# EAGLE design MaTouch Lite ESP32-S3 SPI TFT with Touch 3.95'' ST7796 v1.1 (EAGLE 6.1)
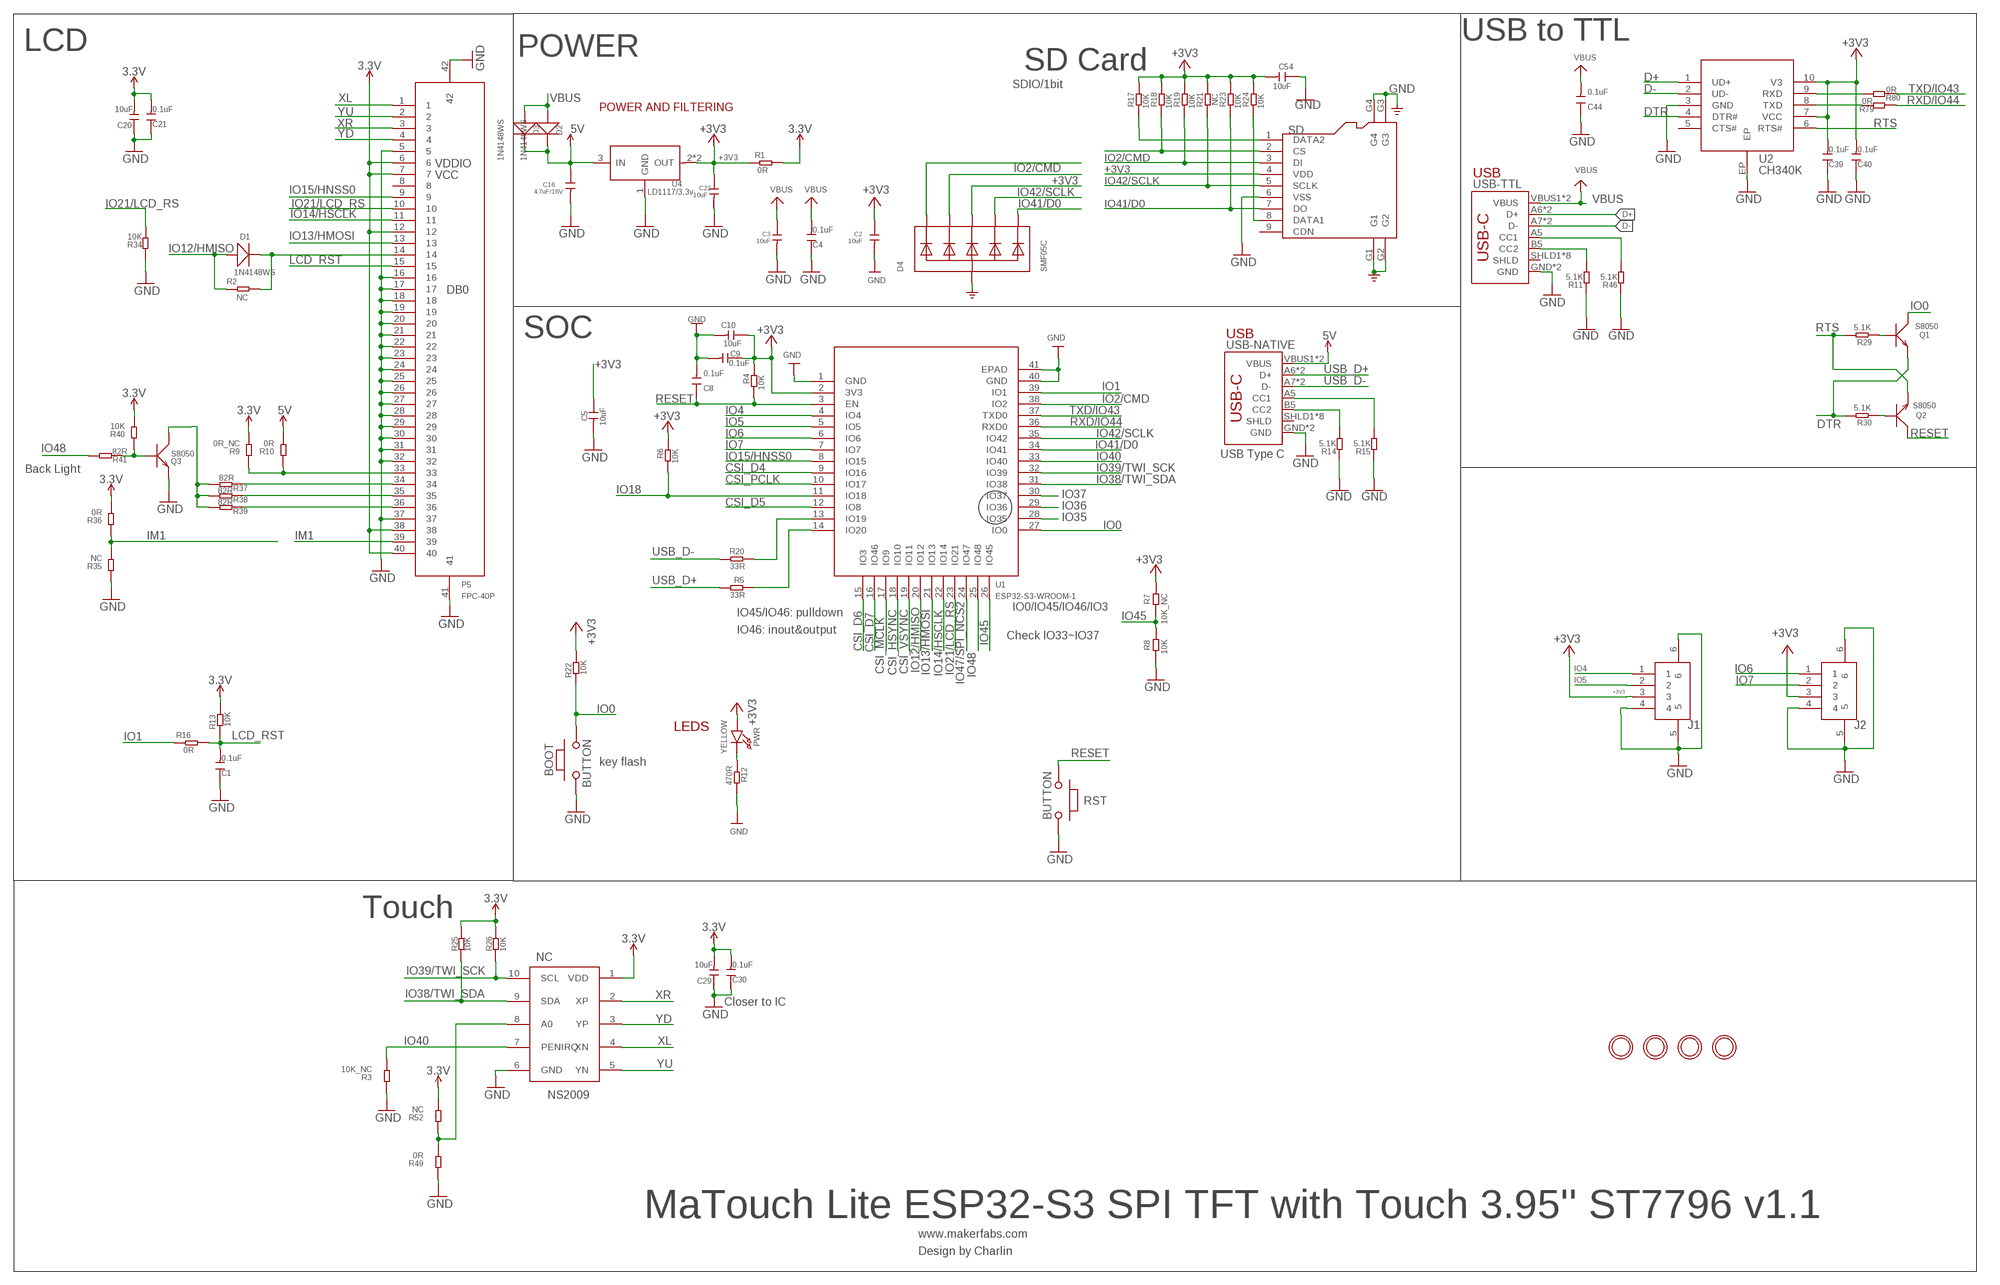
[diagram p0: schematic, sheet 1]

## Parts
BOOT  BUTTON  PB157  [157SW]
C1  0.1uF  DISCRETE_C-0603  [DISCRETE_C0603]
C2  10uF  C-0603  [0603]
C3  10uF  C-0603  [0603]
C4  0.1uF  DISCRETE_C-0603  [DISCRETE_C0603]
C5  10uF  DISCRETE_C-0603  [DISCRETE_C0603]
C8  0.1uF  DISCRETE_C-0603  [DISCRETE_C0603]
C9  0.1uF  DISCRETE_C-0603  [DISCRETE_C0603]
C10  10uF  DISCRETE_C-0603  [DISCRETE_C0603]
C16  4.7uF/16V  C-0603  [0603]
C20  10uF  DISCRETE_C-0603  [DISCRETE_C0603]
C21  0.1uF  DISCRETE_C-0603  [DISCRETE_C0603]
C22  10uF  C-0603  [0603]
C29  10uF  DISCRETE_C-0603  [DISCRETE_C0603]
C30  0.1uF  DISCRETE_C-0603  [DISCRETE_C0603]
C39  0.1uF  DISCRETE_C-0603  [DISCRETE_C0603]
C40  0.1uF  DISCRETE_C-0603  [DISCRETE_C0603]
C44  0.1uF  DISCRETE_C-0603  [DISCRETE_C0603]
C54  10uF  DISCRETE_C-0603  [DISCRETE_C0603]
D1  1N4148WS  D'0805'  [SOD323]
D2  1N4148WS  D'0805'  [SOD323]
D3  1N4148WS  D'0805'  [SOD323]
D4  SMF05C  TVSARRAY_5LANE  [SOT363]
H1  MICROBUILDER_MOUNTINGHOLE3.0THIN  [MICROBUILDER_MOUNTINGHOLE_3.0_PLATEDTHIN]
H2  MICROBUILDER_MOUNTINGHOLE3.0THIN  [MICROBUILDER_MOUNTINGHOLE_3.0_PLATEDTHIN]
H3  MICROBUILDER_MOUNTINGHOLE3.0THIN  [MICROBUILDER_MOUNTINGHOLE_3.0_PLATEDTHIN]
H4  MICROBUILDER_MOUNTINGHOLE3.0THIN  [MICROBUILDER_MOUNTINGHOLE_3.0_PLATEDTHIN]
J1  CON4-1.25P-SMD  [SMD4-125P-1000L525W350H]
J2  CON4-1.25P-SMD  [SMD4-125P-1000L525W350H]
P5  FPC-40P  [SMD42-50P-2560L490W]
PWR  YELLOW  LED0805_NOOUTLINE  [CHIPLED_0805_NOOUTLINE]
Q1  S8050  TRANSISTOR-NPN-SOT23  [SOT23]
Q2  S8050  TRANSISTOR-NPN-SOT23  [SOT23]
Q3  S8050  TRANSISTOR-NPN-SOT23  [SOT23]
R1  0R  R-0603  [R0603]
R2  NC  R-0603  [R0603]
R3  10K_NC  DISCRETE_R-0603  [DISCRETE_R0603]
R4  10K  R-0603  [R0603]
R5  33R  R-0603  [R0603]
R6  10K  R-0603  [R0603]
R7  10K_NC  R-0603  [R0603]
R8  10K  R-0603  [R0603]
R9  0R_NC  DISCRETE_R-0603  [DISCRETE_R0603]
R10  0R  DISCRETE_R-0603  [DISCRETE_R0603]
R11  5.1K  DISCRETE_R-0603  [DISCRETE_R0603]
R12  470R  R-0603  [R0603]
R13  10K  R-0603  [R0603]
R14  5.1K  DISCRETE_R-0603  [DISCRETE_R0603]
R15  5.1K  DISCRETE_R-0603  [DISCRETE_R0603]
R16  0R  R-0603  [R0603]
R17  10K  R-0603  [R0603]
R18  10K  R-0603  [R0603]
R19  10K  R-0603  [R0603]
R20  33R  R-0603  [R0603]
R21  NC  R-0603  [R0603]
R22  10K  R-0603  [R0603]
R23  10K  R-0603  [R0603]
R24  10K  R-0603  [R0603]
R25  10K  R-0603  [R0603]
R26  10K  R-0603  [R0603]
R29  5.1K  R-0603  [R0603]
R30  5.1K  R-0603  [R0603]
R34  10K  DISCRETE_R-0603  [DISCRETE_R0603]
R35  NC  DISCRETE_R-0603  [DISCRETE_R0603]
R36  0R  DISCRETE_R-0603  [DISCRETE_R0603]
R37  82R  DISCRETE_R-0603  [DISCRETE_R0603]
R38  82R  DISCRETE_R-0603  [DISCRETE_R0603]
R39  82R  DISCRETE_R-0603  [DISCRETE_R0603]
R40  10K  DISCRETE_R-0603  [DISCRETE_R0603]
R41  82R  DISCRETE_R-0603  [DISCRETE_R0603]
R46  5.1K  DISCRETE_R-0603  [DISCRETE_R0603]
R49  0R  DISCRETE_R-0603  [DISCRETE_R0603]
R52  NC  DISCRETE_R-0603  [DISCRETE_R0603]
R79  0R  R-0603  [R0603]
R80  0R  R-0603  [R0603]
RST  BUTTON  PB157  [157SW]
SD  HOLDER-MICROSD-9P  [9P-SMD-W/-RING]
U1  ESP32-S3-WROOM-1  [ESP32-S3-WROOM-1]
U2  CH340K  [ESOP-10-EP-150MIL]
U4  LD1117/3.3v  LD1117'SOT89'  [SOT89]
U8  NS2009  [MSOP10]
USB-NATIVE  USB_C5  [USB-C-16P-5]
USB-TTL  USB_C5  [USB-C-16P-5]

## Nets
5V: C16.1 D2.- D3.- R10.2 U4.3(IN) USB-NATIVE.VBUS1(VBUS) USB-NATIVE.VBUS2(VBUS)
+3V3: C2.1 C5.1 C9.1 C10.1 C20.2 C21.2 C22.1 C29.2 C30.2 C39.2 C40.2 C54.2 D4.4(C3) J1.3 J2.3 P5.6 P5.7 P5.12 P5.38 P5.40 PWR.A R1.1 R1.2 R4.2 R6.2 R7.2 R9.2 R13.2 R17.2 R18.2 R19.2 R21.2 R22.2 R23.2 R24.2 R25.2 R26.2 R36.2 R40.2 R52.2 SD.4(VDD) U1.2(3V3) U2.7(VCC) U2.10(V3) U4.2(OUT) U4.4(OUT) U8.1(VDD) ; supply symbol labelled 3.3V
CSI_D4: U1.9(IO16)
CSI_D5: U1.12(IO8)
CSI_D6: U1.15(IO3)
CSI_D7: U1.16(IO46)
CSI_HSYNC: U1.18(IO10)
CSI_MCLK: U1.17(IO9)
CSI_PCLK: U1.10(IO17)
CSI_VSYNC: U1.19(IO11)
D+: U2.1(UD+) USB-TTL.A6(D+) USB-TTL.B6(D+)
D-: U2.2(UD-) USB-TTL.A7(D-) USB-TTL.B7(D-)
DTR: Q1.2(E) R30.2 U2.4(DTR#)
GND: BOOT.1 C1.1 C2.2 C3.2 C4.1 C5.2 C8.2 C9.2 C10.2 C16.2 C20.1 C21.1 C22.2 C29.1 C30.1 C39.1 C40.1 C44.1 C54.1 D4.2(A) J1.4 J1.5 J1.6 J2.4 J2.5 J2.6 P5.5 P5.16 P5.17 P5.18 P5.19 P5.20 P5.21 P5.22 P5.23 P5.24 P5.25 P5.26 P5.27 P5.28 P5.29 P5.30 P5.31 P5.32 P5.37 P5.41 P5.42 Q3.2(E) R3.1 R8.1 R11.1 R12.2 R14.1 R15.1 R34.1 R35.1 R46.1 R49.1 RST.1 SD.6(VSS) SD.G1 SD.G2 SD.G3 SD.G4 U1.1(GND) U1.40(GND) U1.41(EPAD) U2.3(GND) U2.EP U4.1(GND) U8.6(GND) USB-NATIVE.GND USB-NATIVE.GND2(GND) USB-TTL.GND USB-TTL.GND2(GND)
IM1: P5.39 R35.2 R36.1
IO0: BOOT.2 Q1.3(C) R22.1 U1.27(IO0)
IO1: R16.1 U1.39(IO1)
IO1/CS: D4.1(C1) R18.1 SD.2(CS)
IO2/CMD: D4.3(C2) R19.1 SD.3(DI) U1.38(IO2)
IO4: J1.1 U1.4(IO4)
IO5: J1.2 U1.5(IO5)
IO6: J2.1 U1.6(IO6)
IO7: J2.2 U1.7(IO7)
IO12/HMISO: D1.+ R2.1 U1.20(IO12)
IO13/HMOSI: P5.13 U1.21(IO13)
IO14/HSCLK: P5.11 U1.22(IO14)
IO15/HNSS0: P5.9 U1.8(IO15)
IO18: R6.1 U1.11(IO18)
IO21/LCD_RS: P5.10 R34.2 U1.23(IO21)
IO35: U1.28(IO35)
IO36: U1.29(IO36)
IO37: U1.30(IO37)
IO38/TWI_SDA: R25.1 U1.31(IO38) U8.9(SDA)
IO39/TWI_SCK: R26.1 U1.32(IO39) U8.10(SCL)
IO40: R3.2 U1.33(IO40) U8.7(PENIRQ)
IO41/D0: D4.6(C5) R23.1 SD.7(DO) U1.34(IO41)
IO42/SCLK: D4.5(C4) R21.1 SD.5(SCLK) U1.35(IO42)
IO45: R7.1 R8.2 U1.26(IO45)
IO47/SPI_NCS2: U1.24(IO47)
IO48: R41.2 U1.25(IO48)
LCD_RST: C1.2 P5.15 R13.1 R16.2
N$1: R46.2 USB-TTL.A5(CC1)
N$4: D1.- P5.14 R2.2
N$5: Q2.1(B) R30.1
N$7: PWR.C R12.1
N$8: Q1.1(B) R29.1
N$14: R15.2 USB-NATIVE.A5(CC1)
N$15: R20.2 U1.13(IO19)
N$16: R5.2 U1.14(IO20)
N$17: R14.2 USB-NATIVE.B5(CC2)
N$18: R11.2 USB-TTL.B5(CC2)
N$20: P5.34 R37.1
N$21: P5.35 R38.1
N$22: P5.36 R39.1
N$23: Q3.1(B) R40.1 R41.1
N$24: Q3.3(C) R37.2 R38.2 R39.2
N$25: R49.2 R52.1 U8.8(A0)
N$26: P5.33 R9.1 R10.1
N$36: R80.2 U2.9(RXD)
N$37: R79.2 U2.8(TXD)
N$47: R17.1 SD.1(DATA2)
N$48: R24.1 SD.8(DATA1)
RESET: C8.1 Q2.3(C) R4.1 RST.2 U1.3(EN)
RTS: Q2.2(E) R29.2 U2.6(RTS#)
RXD/IO44: R79.1 U1.36(RXD0)
TXD/IO43: R80.1 U1.37(TXD0)
USB_D+: R5.1 USB-NATIVE.A6(D+) USB-NATIVE.B6(D+)
USB_D-: R20.1 USB-NATIVE.A7(D-) USB-NATIVE.B7(D-)
VBUS: C3.1 C4.2 C44.2 D2.+ D3.+ USB-TTL.VBUS1(VBUS) USB-TTL.VBUS2(VBUS)
XL: P5.1 U8.4(XN)
XR: P5.3 U8.2(XP)
YD: P5.4 U8.3(YP)
YU: P5.2 U8.5(YN)
Unconnected: P5.8 SD.9(CDN) U2.5(CTS#) USB-NATIVE.SHLD1(SHLD) USB-NATIVE.SHLD2(SHLD) USB-NATIVE.SHLD3(SHLD) USB-NATIVE.SHLD4(SHLD) USB-NATIVE.SHLD5(SHLD) USB-NATIVE.SHLD6(SHLD) USB-NATIVE.SHLD7(SHLD) USB-NATIVE.SHLD8(SHLD) USB-TTL.SHLD1(SHLD) USB-TTL.SHLD2(SHLD) USB-TTL.SHLD3(SHLD) USB-TTL.SHLD4(SHLD) USB-TTL.SHLD5(SHLD) USB-TTL.SHLD6(SHLD) USB-TTL.SHLD7(SHLD) USB-TTL.SHLD8(SHLD)

## Notes on the sheet
- USB to TTL
- LCD | POWER
- SD Card
- SDIO/1bit
- POWER AND FILTERING
- VDDIO
- VCC | USB
- DB0
- SOC | USB
- USB Type C
- Back Light
- IO0/IO45/IO46/IO3
- IO45/IO46: pulldown
- IO46: inout&output
- Check IO33~IO37
- LEDS
- key flash
- Touch
- NC
- Closer to IC
- NS2009
- MaTouch Lite ESP32-S3 SPI TFT with Touch 3.95'' ST7796 v1.1
- www.makerfabs.com
- Design by Charlin

## Library data of the parts
BOOT RST = MySMD:PB157
C1 C4 C5 C8-C10 C20 C21 C29 C30 C39 C40 C44 C54 = A9G:DISCRETE_C*: Ceramic Capacitors
C2 C3 C16 C22 = Discrete:C*: Ceramic Capacitors
D1-D3 = Discrete:D*
D4 = microbuilder:TVSARRAY_5LANE: Voltage Transient Suppressor Array SOT363 SMF05C - 100W 5V: Digikey - SMF05CT1GOSCT-ND
H1-H4 = Adafruit UDA1334 I2S DAC:MICROBUILDER_MOUNTINGHOLE: Mounting Hole For #2 screws (0.086"/2.18mm width, 0.094"/2.4mm hole) use 2.5mm; BOM: EXCLUDE
J1 J2 = user:CON4-1.25P-SMD
P5 = self:FPC-40P
PWR = microbuilder:LED: LED 0603 - 0603 Surface Mount Package 2mA: Green LED - Low Power (3.9mcd, 2ma, 1.7Vf) - Digikey: 475-2709-2-ND Orange LED - Low Power (9.8mcd, 2ma, 1.8Vf) - Digikey: 475-1194-2-ND Red LED - Low Power (5mcd, 2ma, 1.8Vf) - Digikey: 475-1195-2-ND Yellow LED - Low Power (7mcd, 2ma, 1.8Vf) - Digikey: 475-1196-2-ND 5mA: Blue LED - Low Power (17mcd, 5ma, 2.9Vf) - Digikey: LNJ937W8CRACT-ND 0805 - 0805 Surface Mount Package 2mA: Red LED (8.8mcd, 2mA, 1.8Vf, Clear) - Low Power [Digikey: 475-2510-1-ND] Green LED (5mcd, 2mA, 1.8Vf, Clear) - Low Power [Digikey: 475-2730-1-ND] Yellow LED (11.3mcd, 2mA, 1.8Vf, Clear) - Low Power [Digikey: 475-2555-1-ND] 20mA: Red LED (104mcd, 20mA, Diffused) - LS R976 [Digikey: 475-1278-6-ND] Red LED (12mcd, 20mA, 2.0Vf, Clear) - APT2012EC [Digikey: 754-1128-1-ND] Green LED (15mcd, 20mA, 2.2Vf, Clear) - APT2012GC [Digikey: 754-1131-1-ND] Orange LED (160mcd, 20mA, 2.1Vf, Clear) - APT2012SECK [Digikey: 754-1130-1-ND] 1206 - 1206 Surface Mount Package Green LED (26mcd, 20mA, Diffused) - LG N971 [Digikey: 475-1407-6-ND] Red LED (15mcd, 20mA, Diffused) - LH N974 [Digikey: 475-1416-6-ND] Cree - Cree High-Power Surface Mount LEDs XPEBWT-L1-0000-00D50 - White 111lm 350mA 2.9Vf 6200K 110° XTEAWT-00-0000-00000LEE3 - White 114lm 350mA 2.85Vf 5000K 115° Everlight - Everlight 45-21 Series Surface Mount LEDs 45-21/QK2C-B2832AC2CB2/2T - Warm White 2000mcd 20mA 3.25Vf 3050K 120° 45-21/LK2C-B38452C4CB2/2T - Nuetral White 2000mcd 20mA 3.25Vf 4150K 120° 45-21/LK2C-B50634C6CB2/2T - Cold White 2200mcd 20mA 3.25Vf 5650K 120° PLCC2 Reverse Mount LS T77K-J1L2-1-0-2-R18-Z - Red 11.25mcd 2mA 1.8Vf 630nm 120° LO T77K-L1M2-24-Z - Orange 19.6mcd 2mA 1.8Vf 606nm 120° LY T77K-K2M1-26-Z - Yellow 15.7mcd 2mA 1.8Vf 587nm 120°
Q1-Q3 = Discrete:TRANSISTOR-NPN*: NPN audion
R1 R2 R4-R8 R12 R13 R16-R26 R29 R30 R79 R80 = Discrete:R*
R3 R9-R11 R14 R15 R34-R41 R46 R49 R52 = A9G:DISCRETE_R*
SD = Connector:HOLDER-MICROSD-9P
U1 = self:ESP32-S3-WROOM-1
U2 = sale:CH340K
U4 = IC:LD1117: Low Drop Fixed And Adjustable Positive Voltage Regulators http://www.datasheetcatalog.org/datasheet/SGSThomsonMicroelectronics/mXuqtqv.pdf
U8 = NS2009:NS2009
USB-NATIVE USB-TTL = USBC:USB_C: USB Type C 16Pin Connector Super Speed pins not available on the 16-pin purely SMD connector so this part is best for USB 2.0 implementations. D1 and D2 are tied together enabling D+/- no matter which way the cable is plugged into the connector. The two channel configuration pins (CC1/2) are exposed. These are normally connected to ground via 5.1k resistors but can be reconfigured for high current/high power applications.

## Net classes
0 default: width 0.203 mm, drill 0.305 mm, clearance 0.152 mm
1 vbat: width 0.254 mm, drill 0.305 mm, clearance 0.152 mm

## Board
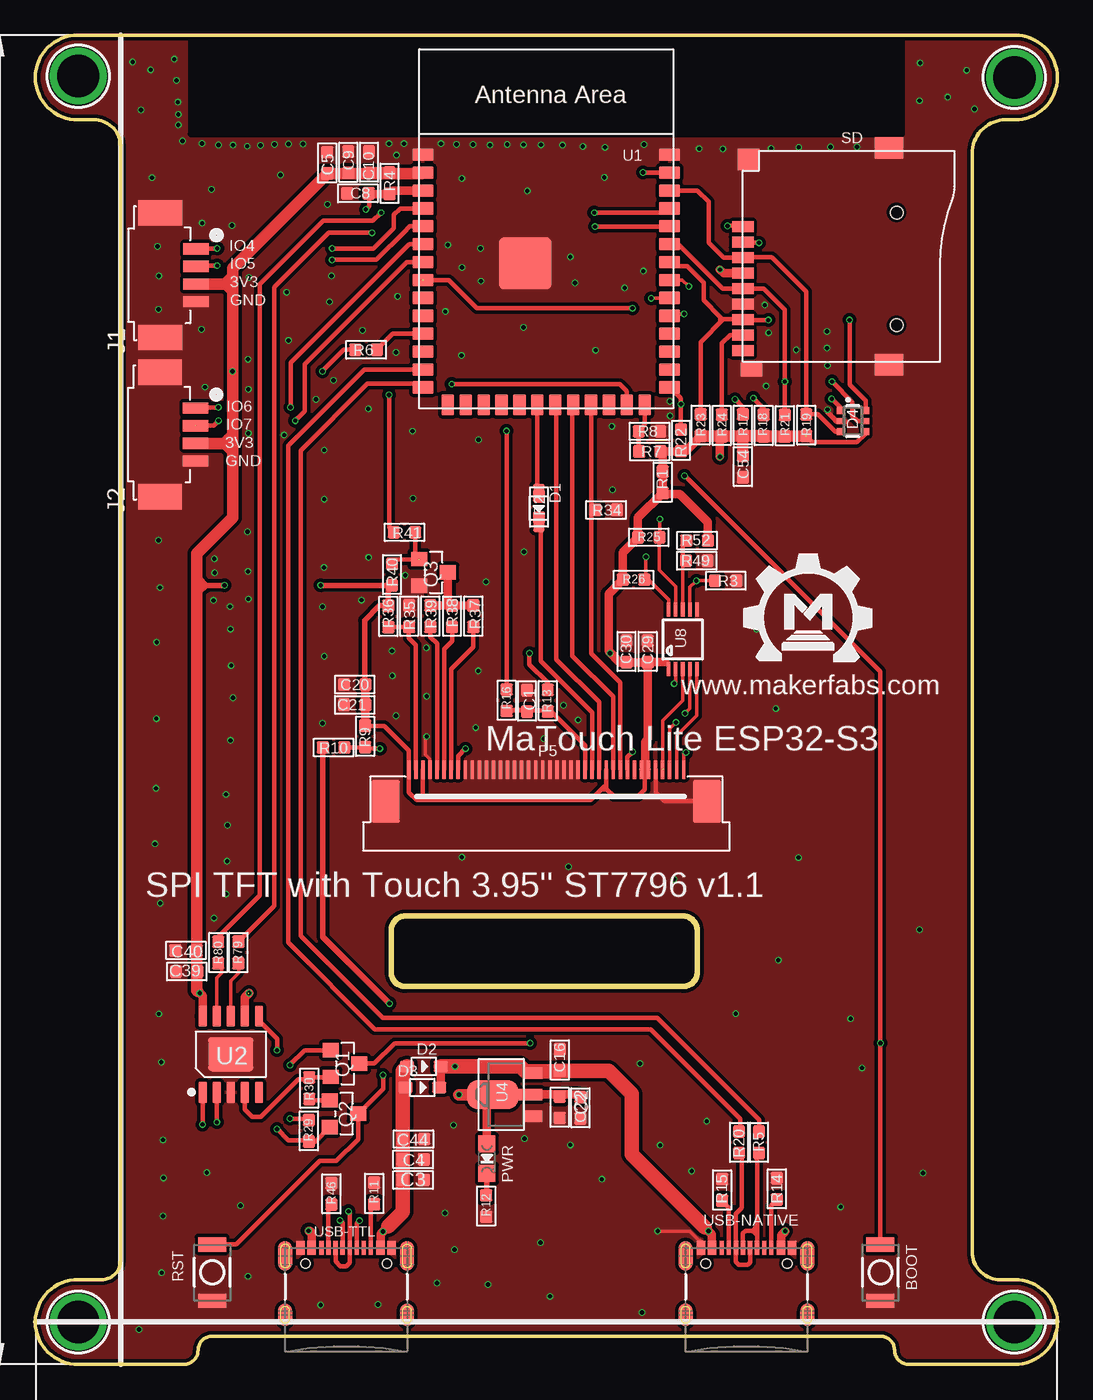
[diagram p1: board, top side]
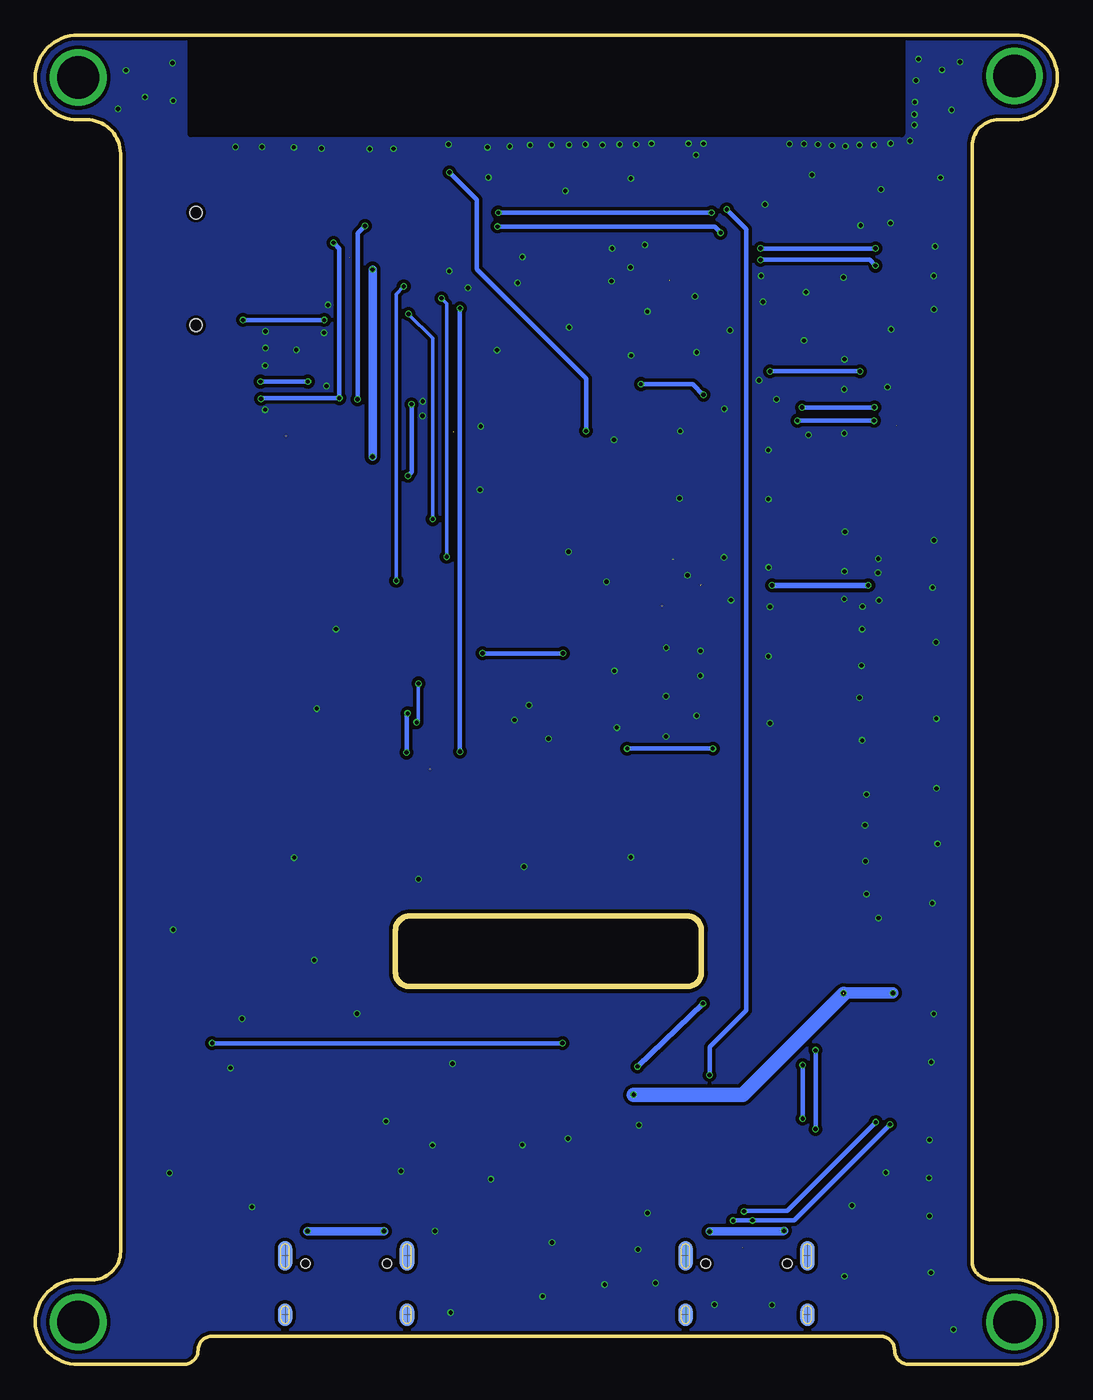
[diagram p2: board, bottom side, seen from below]

Size 72.5 x 94.3 mm. Coordinates in mm from the lower left corner, seen from the top.
Outline: 61.95,0 69.45,0 arc182 69.45,6 68.45,6 arc-90 66.45,8 66.45,85.9 arc-90 68.85,88.3 69.45,88.3 arc182 69.45,94.3 3.05,94.3 arc182 3.05,88.3 4.17,88.3 arc-90 6.05,86.42 6.05,7.34 arc-90 4.7,6 3.05,6 arc182 3.05,0 10.55,0 arc90 11.55,1 arc-90 12.55,2 59.95,2 arc-90 60.95,1 arc90 61.95,0
Outline: 26.25,31.8 45.95,31.8 arc-90 46.95,30.8 46.95,27.8 arc-90 45.95,26.8 26.25,26.8 arc-90 25.25,27.8 25.25,30.8 arc-90 26.25,31.8
Copper layers (1*16): Top 0.035mm / dielectric 1.5mm / Bottom 0.035mm
Design rules: minimum track width 6mil, minimum drill 10mil, track to track 8mil, track to pad 8mil, pad to pad 8mil, via to via 8mil, smd to smd 0mil, copper to edge 10mil, drill to drill 10mil, minimum pad ring 3mil, minimum via ring 3mil, stop-mask expansion 2mil, vias tented up to drill 100mil, thermal gap 0mil
tRestrict: area 11,87.3 to 61.4,95
bRestrict: area 11,87.3 to 61.4,95

### Footprints (pad centres in the part's own frame; a part is rotated, then mirrored left to right if it is on the bottom)
157SW = smd 1.016 x 1.981: 1 0,0; 2 4,0
DISCRETE_C0603 = smd 0.889 x 0.889: 1 -0.762,0; 2 0.762,0
0603 = smd 0.889 x 0.889: 1 -0.762,0; 2 0.762,0
SOD323 = smd 1 x 0.8: + -1.2,0; - 1.2,0
SOT363 = smd 0.5 x 0.5: 1 -0.75,-0.9; 3 0.75,-0.9; 4 0.75,0.9; 6 -0.75,0.9 | smd 0.4 x 0.5: 2 0,-0.9; 5 0,0.9
MICROBUILDER_MOUNTINGHOLE_3.0_PLATEDTHIN = drill 3 pad 3.6: P$1 0,0
SMD4-125P-1000L525W350H = smd 0.8 x 1.8: 1 -1.875,1.266; 2 -0.625,1.266; 3 0.625,1.266; 4 1.875,1.266 | smd 1.8 x 3.1: 5 4.425,-1.266; 6 -4.425,-1.266
SMD42-50P-2560L490W = smd 0.3 x 1.3: 1 9.75,0; 2 9.25,0; 3 8.75,0; 4 8.25,0; 5 7.75,0; 6 7.25,0; 7 6.75,0; 8 6.25,0; 9 5.75,0; 10 5.25,0; 11 4.75,0; 12 4.25,0; 13 3.75,0; 14 3.25,0; 15 2.75,0; 16 2.25,0; 17 1.75,0; 18 1.25,0; 19 0.75,0; 20 0.25,0; 21 -0.25,0; 22 -0.75,0; 23 -1.25,0; 24 -1.75,0; 25 -2.25,0; 26 -2.75,0; 27 -3.25,0; 28 -3.75,0; 29 -4.25,0; 30 -4.75,0; 31 -5.25,0; 32 -5.75,0; 33 -6.25,0; 34 -6.75,0; 35 -7.25,0; 36 -7.75,0; 37 -8.25,0; 38 -8.75,0; 39 -9.25,0; 40 -9.75,0 | smd 2 x 3: 41 -11.4,-2.25; 42 11.4,-2.25
CHIPLED_0805_NOOUTLINE = smd 1.2 x 1.2: A 0,-1.05; C 0,1.05
SOT23 = smd 1.016 x 1.143: 1 -0.95,-1.016; 2 0.95,-1.016; 3 0,1.016
R0603 = smd 0.889 x 0.889: 1 -0.762,0; 2 0.762,0
DISCRETE_R0603 = smd 0.889 x 0.889: 1 -0.762,0; 2 0.762,0
9P-SMD-W/-RING = smd 1.524 x 0.762: 1 0,4.4; 2 0,3.3; 3 0,2.2; 4 0,1.1; 5 0,0; 6 0,-1.1; 7 0,-2.2; 8 0,-3.3; 9 0,-4.4 | smd 1.524 x 1.016: G1 0.6,-5.746 | smd 2.032 x 1.524: G2 10.373,-5.4; G3 10.373,10 | smd 1.524 x 1.524: G4 0.392,9.181 | hole 0.889: 10.9,-2.6; 10.9,5.4
ESP32-S3-WROOM-1 = smd 1.5 x 0.9: 1 -8.75,5.26; 2 -8.75,3.99; 3 -8.75,2.72; 4 -8.75,1.45; 5 -8.75,0.18; 6 -8.75,-1.09; 7 -8.75,-2.36; 8 -8.75,-3.63; 9 -8.75,-4.9; 10 -8.75,-6.17; 11 -8.75,-7.44; 12 -8.75,-8.71; 13 -8.75,-9.98; 14 -8.75,-11.25; 27 8.75,-11.25; 28 8.75,-9.98; 29 8.75,-8.71; 30 8.75,-7.44; 31 8.75,-6.17; 32 8.75,-4.9; 33 8.75,-3.63; 34 8.75,-2.36; 35 8.75,-1.09; 36 8.75,0.18; 37 8.75,1.45; 38 8.75,2.72; 39 8.75,3.99; 40 8.75,5.26 | smd 0.9 x 1.5: 15 -6.985,-12.5; 16 -5.715,-12.5; 17 -4.445,-12.5; 18 -3.175,-12.5; 19 -1.905,-12.5; 20 -0.635,-12.5; 21 0.635,-12.5; 22 1.905,-12.5; 23 3.175,-12.5; 24 4.445,-12.5; 25 5.715,-12.5; 26 6.985,-12.5 | smd 3.7 x 3.7: 41 -1.5,-2.46
ESOP-10-EP-150MIL = smd 1.5 x 0.6: 1 -2.7,2; 2 -2.7,1; 3 -2.7,0; 4 -2.7,-1; 5 -2.7,-2; 6 2.7,-2; 7 2.7,-1; 8 2.7,0; 9 2.7,1; 10 2.7,2 | smd 2.4 x 3.2: EP 0,0
SOT89 = smd 0.8 x 1.4: 1 -1.524,-1.905; 3 1.524,-1.905 | smd 0.8 x 1.9: 2 0,-1.651 | smd 2.032 x 3.65: 4 0,0.94
MSOP10 = smd 0.25 x 1: 1 -1,-2.113; 2 -0.5,-2.113; 3 0,-2.113; 4 0.5,-2.113; 5 1,-2.113; 6 1,2.113; 7 0.5,2.113; 8 0,2.113; 9 -0.5,2.113; 10 -1,2.113
USB-C-16P-5 = smd 0.3 x 1: A5 -1.25,-0.34; A6 -0.25,-0.34; A7 0.25,-0.34; A8 1.25,-0.34; B5 1.75,-0.34; B6 0.75,-0.34; B7 -0.75,-0.34; B8 -1.75,-0.34 | smd 0.6 x 1: GND -3.225,-0.34; GND2 3.225,-0.34; VBUS1 -2.45,-0.34; VBUS2 2.45,-0.34 | smd 1 x 2.1: SHLD1 -4.32,-0.915; SHLD2 4.32,-0.915 | smd 1 x 2.1 bottom: SHLD3 -4.32,-0.915; SHLD4 4.32,-0.915 | smd 1 x 1.6: SHLD5 -4.32,-5.095; SHLD8 4.32,-5.095 | smd 1 x 1.6 bottom: SHLD6 -4.32,-5.095; SHLD7 4.32,-5.095 | hole 0.65: -2.89,-1.445; 2.89,-1.445

### Placement (x,y rotation side)
BOOT  59.95,4.5 90 top
C1  34.88,47.07 270 top
C2  37.19,18.24 270 top
C3  26.8,13.08 0 top
C4  26.8,14.53 180 top
C5  20.7,85.24 90 top
C8  22.89,83.08 180 top
C9  22.2,85.29 90 top
C10  23.68,85.29 90 top
C16  37.21,21.59 90 top
C20  22.66,48.23 0 top
C21  22.66,46.79 0 top
C22  38.66,18.2 270 top
C29  43.44,50.57 270 top
C30  41.94,50.57 270 top
C39  10.75,27.86 0 top
C40  10.7,29.36 0 top
C44  26.83,15.98 180 top
C54  50.19,63.69 90 top
D1  35.72,60.76 270 top
D2  27.56,21.13 0 top
D3  27.46,19.63 0 top
D4  57.99,66.92 270 top
H1  3.05,3 0 top
H2  69.45,3 0 top
H3  3.05,91.4 0 top
H4  69.45,91.3 0 top
J1  10.14,77.27 270 top
J2  10.11,65.96 270 top
P5  36.25,42.2 0 top
PWR  32.03,14.59 180 top
Q1  21.97,21.34 270 top
Q2  21.9,17.78 270 top
Q3  28.25,56.18 270 top
R1  44.5,62.59 270 top
R2  35.73,60.83 270 top
R3  48.97,55.6 180 top
R4  25.12,83.79 90 top
R5  51.34,15.75 90 top
R6  23.47,71.98 180 top
R7  43.59,64.77 0 top
R8  43.57,66.19 180 top
R9  23.4,44.55 90 top
R10  21.16,43.76 180 top
R11  24.03,12.12 270 top
R12  31.98,11.23 270 top
R13  36.35,47.09 90 top
R14  52.61,12.45 270 top
R15  48.72,12.37 270 top
R16  33.43,47.12 270 top
R17  50.19,66.64 270 top
R18  51.67,66.61 270 top
R19  54.69,66.64 270 top
R20  49.91,15.75 90 top
R21  53.17,66.59 270 top
R22  45.8,65.56 270 top
R23  47.2,66.64 270 top
R24  48.69,66.61 270 top
R25  43.51,58.67 180 top
R26  42.45,55.68 180 top
R29  19.41,16.56 270 top
R30  19.43,19.58 90 top
R34  40.49,60.61 180 top
R35  26.51,53.08 270 top
R36  25.05,53.06 90 top
R37  31.07,53.09 90 top
R38  29.56,53.09 90 top
R39  28.03,53.09 90 top
R40  25.3,56.03 270 top
R41  26.19,59.03 180 top
R46  21.01,12.09 270 top
R49  46.92,57.02 180 top
R52  46.94,58.45 0 top
R79  14.4,29.21 270 top
R80  12.98,29.21 270 top
RST  12.55,4.5 90 top
SD  50.19,76.32 0 top
U1  36.25,80.56 0 top
U2  13.87,22 90 top
U4  33.37,19.14 90 top
U8  45.93,51.44 0 top
U$1  [MAKERFABS_0.3]  50.7,49.9 0 top
USB-NATIVE  50.45,8.6 0 top
USB-TTL  22.05,8.6 0 top

### Tracks (layer width: path | path; a pad name or v marks a point on that pad's centre or on a via)
5V  (via drill 0.3)
  Top 0.254: U4.3 35.16,20.78 34.78,20.78
  Top 0.406: R10.2 20.4,30.33 v25.12,25.6 | v29.77,21.13 D2.-
  Top 0.61: USB-NATIVE.VBUS2 52.9,9.16 v53.19,9.45 | v47.76,9.45 47.81,9.4 47.81,9.37 | USB-NATIVE.VBUS1 48,9.21 v47.76,9.45 | v47.76,9.45 47.5,9.7 | D3.- 28.76,19.63 D2.-
  Top 1.016: D2.- v29.77,21.13 34.39,21.13 34.75,20.78 34.78,20.78 37.16,20.78 C16.1 37.14,20.83 37.11,20.8 40.69,20.8 42.29,19.2 42.29,14.91 47.5,9.7
  Bottom 0.406: v25.12,25.6 v29.77,21.13
  Bottom 0.61: v53.19,9.45 v47.76,9.45
+3V3  (via drill 0.3)  (3 unrouted)
  Top 0.254: P5.6 43.49,41.68 43.23,41.68 43.23,42.72 43.03,42.72 43.26,42.72 43.46,42.72 43.46,41.86 | U8.1 44.93,49.59 44.68,49.84
  Top 0.305: D4.4 58.89,66.05 58.27,65.43 55.12,65.43 54.69,65.86 | 13.9,64.54 13.08,65.35 13.77,66.04 13.95,66.04 arc-90 14,65.99 | 13.95,75.89 13.16,76.68 13.82,77.34 13.97,77.34 arc90 14,77.37 | R9.2 23.42,45.29 24.77,45.29 26.5,43.56 P5.40 26.5,40.59 27.05,40.03 27.23,40.03 | U2.7 14.87,24.72 14.89,24.74 | R6.2 21.9,71.98 v20.37,70.46 | v14,70.46 14,70.36 | P5.12 40.5,40.84 | 40.5,40.84 40.54,40.79 | 40.54,40.79 41.02,40.31 42.78,40.31 43.23,40.77 43.23,40.97 43.23,41.68 | P5.7 P5.6 | R13.2 36.35,48.36 35.06,49.66 v35.06,50.44 | v40.77,50.44 40.9,50.44 41.53,49.81 41.91,49.81 C30.2 | 40.57,40.74 40.5,40.81 40.5,40.84 | 40.16,40.79 40.35,40.98 | 40.35,40.98 40.41,41.05 | 40.41,41.05 40.49,41.12 | 40.5,40.84 40.35,40.98 | 27.23,40.03 27.49,40.03 | 27.49,40.03 27.77,40.03 | 27.77,40.03 39.4,40.03 40.14,40.77 | 40.14,40.77 40.41,41.05 | 40.41,41.05 40.41,40.92 40.54,40.79 | 40.54,40.79 40.16,40.79 | 40.16,40.79 40.14,40.77 | P5.38 27.5,40.04 27.49,40.03 | 27.23,40.03 27.49,40.31 27.77,40.03 | 11.46,26.54 11.46,27.81 11.48,27.84 | C39.2 11.48,27.86 11.46,27.89 | R22.2 46.08,64.8 46.1,64.77
  Top 0.406: 25.25,55.32 25.05,55.12 R36.2 24.41,53.82 23.37,52.78 23.37,48.11 23.45,48.03 | R40.2 v20.25,55.27 | v13.41,55.27 12.12,55.27 | 12.12,55.27 11.81,55.27 arc-90 11.46,55.63 | 11.59,55.8 12.12,55.27 | 12.12,55.27 11.61,54.76 | 23.45,48.03 23.5,47.98 23.45,48.03 | 23.45,48.03 23.45,48.21 C20.2 | 23.4,48.21 23.4,48.08 23.45,48.03 | 23.45,48.03 23.45,46.81 C21.2
  Top 0.61: R23.2 47.2,65.86 46.1,64.77 R7.2 44.5,64.62 R1.1 R1.2 | R17.2 48.58,65.88 48.57,65.89 v48.57,64.39 | v48.57,77.67 48.82,77.42 50.32,77.42 | 50.32,77.42 | 50.32,77.42 SD.4 | U2.7 14.87,26.04 v15.17,26.34 | U2.10 11.87,26.13 v11.66,26.34 11.53,26.47 | 38.48,19.14 U4.2 U4.4 | 38.48,19.14 arc-90 C22.1 | 38.48,19.14 37.33,19.14 arc90 C2.1 | PWR.A 32.03,19.02 arc90 31.93,19.13 | C29.2 43.44,44.35 43.32,44.23 | 43.32,44.23 43.26,44.17 | 43.26,42.72 43.26,44.17 | 43.26,44.17 43.32,44.23 | R9.2 23.4,48.21 C20.2 | 44.68,49.84 43.46,49.84 C29.2 | C29.2 C30.2 41.91,49.81 41.53,49.81 41.46,49.81 40.67,50.6 40.67,54.66 R26.2 41.68,57.61 R25.2 42.75,60.07 R1.2 | R52.2 47.7,59.77 45.72,61.75 44.58,61.75 R1.2
  Top 0.813: 54.69,65.86 47.21,65.86 | 47.21,65.86 R23.2 | C54.2 R17.2 | 47.21,65.86 48.69,65.86 R24.2 50.17,65.85 R17.2 | R17.2 51.64,65.88 R18.2 51.69,65.83 R21.2 | U1.2 27.43,84.48 25.05,84.48 | 25.05,84.48 C5.1 | 11.53,26.47 11.46,26.54 | 11.46,26.54 11.46,27.89 | 11.46,27.89 C40.2 | U4.4 32.42,19.13 31.93,19.13 v30.05,19.13 | 11.46,26.54 11.46,27.89 | 11.46,27.89 11.46,29.39 11.46,55.63 11.46,57.53 14,60.07 14,65.33 | 14,65.33 14,65.99 14,70.36 v14,70.46 14,76.63 | 14,76.63 14,77.37 14,77.78 C5.1 | C5.1 25.05,84.48 | 25.05,84.48 R4.2 25.1,84.53 C10.1 | 25.05,84.48 22.25,84.48 C9.1 | J1.3 13.99,76.64 14,76.63 | J2.3 13.99,65.34 arc-90 14,65.33
  Bottom 0.305: v20.37,70.46 v14,70.46 | v35.06,50.44 v40.77,50.44
  Bottom 0.406: v20.25,55.27 v13.41,55.27
  Bottom 0.61: v48.57,64.39 v48.57,77.67 | v15.17,26.34 v11.66,26.34
  Bottom 0.813: 15.14,26.36 15.14,26.34 v11.66,26.34
  Bottom 1.016: v30.05,19.13 22.3,19.13 15.14,26.29
D+  (via drill 0.3)
  Top 0.254: USB-TTL.A6 21.8,8.36 21.8,8.59 21.8,10.03 v21.62,10.21
  Top 0.305: USB-TTL.A6 21.8,10.03 v21.62,10.21 | v11.87,17.02 U2.1 | USB-TTL.B6 22.8,9.99 v22.99,10.19
  Bottom 0.305: v11.87,17.02 18.67,10.21 v21.62,10.21 22.96,10.21 v22.99,10.19
D-  (via drill 0.3)  (1 unrouted)
  Top 0.305: U2.2 v12.87,17.18 v12.88,17.17 | v22.23,10.85 22.3,10.69 USB-TTL.A7 | USB-TTL.A7 22.3,7.92 | 22.3,7.92 22.3,7.19 22.08,6.96 21.64,6.96 21.31,7.29 21.3,7.3 USB-TTL.B7 | 22.3,7.92 USB-TTL.A7
  Bottom 0.305: v12.88,17.17 19.15,10.9 22.1,10.9 v22.23,10.85
DTR
  Top 0.305: Q1.2 20.92,20.34 R30.2 19.31,20.22 18.67,20.22 16.01,17.55 15.4,17.55 14.87,18.07 U2.4
GND  (via drill 0.3)
  Top 0.254: P5.37 28,42.95 27.66,43.28 27.66,44.44 v27.76,44.54 | 47.15,8.74 46.43,9.45 v44.15,9.45 v44.15,9.44
  Top 0.305: P5.5 44,40.59 44.63,39.95 P5.42 | 56.16,67.64 56.8,66.9 D4.2 57.42,66.92 57.43,66.9 57.48,66.9 57.46,66.88 56.87,66.88 56.19,67.56 56.19,67.72 v56.19,67.73
  Top 0.406: USB-NATIVE.GND 47.15,8.26 47.15,8.74 | v44.15,9.44 44.17,9.45
  other vias: 64.72,89.91 66.07,91.81 62.77,92.32 62.71,89.65 66.63,89.07 10.11,89.55 9.86,92.6 6.91,92.4 20.73,82.29 51.74,75.15 45.01,68.32 45.04,67.3 40.9,66.54 40.95,62.04 26.24,55.97 27.74,50.84 27.76,47.39 20.37,53.74 23.14,54.22 47.09,86.25 48.77,86.23 52.2,86.28 54.15,86.35 56.42,86.38 58.3,86.38 43.18,86.56 40.41,86.35 38.84,86.4 37.39,86.5 35.87,86.53 34.62,86.53 33.48,86.56 32.26,86.5 31.04,86.56 29.87,86.56 28.78,86.61 26.16,86.61 25.1,86.61 25.63,85.79 19,86.58 17.96,86.58 16.97,86.56 15.98,86.48 15.04,86.43 14.02,86.5 12.99,86.51 11.82,86.61 10.45,86.79 10.15,87.93 10.15,88.67 10.02,91.08 8.19,91.85 34.9,83.25 30.25,84.14 40.36,84.22 41.81,76.37 43.13,77.56 37.95,78.58 39.75,71.95 30.23,71.57 34.62,73.58 29.09,74.69 29.26,79.42 31.63,76.85 31.57,79.16 30.28,77.82 25.71,75.76 23.22,73.35 17.96,72.64 11.79,73.42 12.04,69.33 8.66,79.32 8.74,74.85 8.77,77.23 13.95,80.82 8.28,84.19 17.4,84.4 11.84,80.97 12.5,83.36 7.5,88.99 13.82,53.76 13.54,33.37 13.85,52.16 13.62,35.7 13.9,49.57 13.64,38.24 14.02,47.29 13.54,40.43 13.85,44.26 20.5,50.23 20.37,45.48 25.3,50.61 25.58,46.02 25.33,48.86 31.42,49.19 31.24,45.18 36.1,44.39 38.51,45.71 37.47,46.75 30.25,35.98 37.82,35.3 45.32,34.41 52.71,28.67 62.71,30.83 62.97,13.56 42.9,21.33 47.63,17.24 46.56,13.71 34.7,16.02 36.5,4.82 28.5,5.76 29.06,10.74 37.95,15.56 40.18,13.12 43.03,3.68 32.11,5.66 29.67,16.96 44.33,15.54 57.13,11.17 58.65,21.02 49.68,24.88 57.84,24.53 54.13,35.96 52.53,46.53 51.16,52.16 38.28,76.73 8.74,58.46 8.84,55.11 8.61,51.22 8.59,45.81 8.56,40.86 8.87,32.71 8.49,36.92 8.77,24.86 8.94,21.43 9.07,15.92 12.17,13.61 14.56,11.27 9.07,10.51 9.1,13.23 8.97,6.49 7.37,2.46 15.09,6.24 20.25,4.21 24.31,4.23 29.75,8.15 35.84,8.63 26.75,66.21 31.45,65.6 34.67,57.65 31.98,55.52 26.8,61.44 23.62,67.78 23.65,57.24 20.5,64.86 20.47,56.53 20.5,61.38 56.19,70.86 56.16,73.3 56.16,72.1 53.98,71.98 51.84,69.41 52.02,73.2 19.92,68.47 21.16,69.82 25.58,71.8 21.01,77.23 20.88,75.38 17.83,76.07 15.17,77.11 15.09,71.32 15.12,69.18 15.12,66.06 17.66,65.93 15.06,59.07 15.09,56.25 12.7,57.14 12.73,56.15 15.12,54.3 12.65,54.2 12.68,31.67
  pour Top (isolate 0.254, rank 6): -0.95,95 -0.95,0 72.45,0 72.45,95
  pour Bottom (isolate 0.254, rank 6): 0.05,0 72.45,0 72.45,95 0.05,95
IM1
  Top 0.305: P5.39 27,51.03 26.5,51.54 26.5,52.3 | 26.5,52.3 R35.2 26.5,52.3 | R36.1 26.5,52.3
IO0  (via drill 0.3)
  Top 0.305: R22.1 45.8,67.89 45.8,67.94 | 45.8,67.94 v45.8,68.12 | v45.8,68.12 45.8,68.56 45.01,69.34 45.01,69.32 U1.27 | v59.95,22.78 BOOT.2 v59.95,22.78 | v59.95,22.78 59.95,49.15 v46.05,63.04 | v45.8,68.12 45.8,67.94 | Q1.3 24.06,21.34 25.5,22.78 v35.11,22.78
  Bottom 0.305: v46.05,63.04 45.8,63.3 v45.8,68.12 | v35.11,22.78 v59.95,22.78
IO1  (via drill 0.3)
  Top 0.305: R16.1 v33.43,66.22 | v43.11,84.56 44.99,84.56 | 44.99,84.56 45.01,84.56 44.99,84.56 | U1.39 44.99,84.56
  Bottom 0.305: v33.43,66.22 33.43,69.95 41.18,77.7 41.18,82.63 v43.11,84.56
IO1/CS  (via drill 0.3)
  Top 0.305: R18.1 51.67,67.59 | 51.67,67.59 51.67,67.82 | 51.67,67.82 v50.93,68.56 51.67,67.82 | v51.34,79.58 50.22,79.58 50.22,79.59 SD.2 | D4.1 57.09,67.91 v56.49,68.5 | 51.67,67.82 51.67,67.59 | 51.67,67.59 51.67,67.82
  Bottom 0.305: v51.34,79.58 50.93,79.17 v50.93,68.56 56.44,68.56 arc-90 v56.49,68.5
IO2/CMD  (1 unrouted)
  Top 0.305: U1.38 46.95,83.28 47.76,82.47 47.76,79.58 48.82,78.51 SD.3 | R19.1 54.69,76.1 52.25,78.54 50.21,78.54 SD.3 | D4.3 56.73,66.17 55.5,67.4 R19.1 | R19.1 54.59,67.4 54.56,67.43 54.66,67.43 R19.1
IO4  (via drill 0.3)
  Top 0.305: U1.4 25.88,82.01 25.43,81.56 25.43,80.62 23.98,79.17 v21.06,79.17 | v12.91,79.17 11.43,79.17 J1.1
  Bottom 0.305: v21.06,79.17 v12.91,79.17
IO5  (via drill 0.3)
  Top 0.305: U1.5 26.57,80.74 26.17,80.34 24.18,78.36 v21.06,78.36 | v12.91,77.95 11.46,77.95 J1.2
  Bottom 0.305: v21.06,78.36 13.31,78.36 v12.91,77.95
IO6  (via drill 0.3)
  Top 0.305: U1.6 26.52,79.47 22.96,75.92 18.11,71.07 v18.11,67.89 | v12.98,67.89 11.43,67.89 arc90 J2.1
  Bottom 0.305: v18.11,67.89 v12.98,67.89
IO7  (via drill 0.3)  (1 unrouted)
  Top 0.305: U1.7 26.36,78.2 19.13,70.97 19.13,67.64 v18.44,66.95 | v13.01,66.95 12.65,66.6 J2.2
  Bottom 0.305: v18.44,66.95 v13.01,66.95
IO12/HMISO
  Top 0.305: U1.20 35.61,61.85 | 35.61,61.85 35.66,61.8 35.66,61.66 R2.1 | 35.61,61.85 D1.+
IO13/HMOSI
  Top 0.305: P5.13 40,46.97 36.96,50.01 36.96,67.98 U1.21
IO14/HSCLK
  Top 0.305: P5.11 41,47.37 38.1,50.27 38.1,68.01 U1.22
IO15/HNSS0  (via drill 0.3)  (1 unrouted)
  Top 0.305: P5.9 42,43.09 v42.37,43.46 | v42.37,74.93 31.32,74.93 29.31,76.94 27.51,76.94 27.49,76.96
  Bottom 0.305: v42.37,43.46 v42.37,74.93
IO18
  Top 0.305: R6.1 25.37,73.12 U1.11
IO21/LCD_RS
  Top 0.305: 39.45,60.6 39.45,54.66 39.45,50.42 41.48,48.39 41.5,48.37 P5.10 | 39.45,60.6 39.45,68.25 39.42,68.22 U1.23 | R34.2 39.46,60.62 39.45,60.6
IO38/TWI_SDA  (via drill 0.3)
  Top 0.254: U8.9 45.43,55.19 44.28,56.34 R25.1 44.3,58.7 v44.3,59.97 | v46.03,74.52 45.06,74.52 44.96,74.42 44.97,74.42 U1.31
  Bottom 0.254: v44.3,59.97 44.3,72.8 v46.03,74.52
IO39/TWI_SCK  (via drill 0.3)
  Top 0.254: R26.1 43.51,55.68 43.69,55.5 44.93,54.26 U8.10 44.93,54.24 43.31,55.85 v43.31,57.3 | v43.69,75.64 44.98,75.64 U1.32
  Bottom 0.254: v43.31,57.3 43.31,75.26 v43.69,75.64
IO40  (via drill 0.3)
  Top 0.254: U8.7 46.43,55.13 46.84,55.55 v46.89,55.6 | v46.89,55.6 | R3.2 v46.89,55.6 | v46.89,55.6 | v46.36,76.48 45.9,76.94 45.01,76.94 U1.33
  Bottom 0.254: v46.89,55.6 46.89,75.95 v46.36,76.48
IO41/D0  (via drill 0.3)
  Top 0.305: 48.59,74.3 47.4,75.49 47.4,76.76 46.26,77.9 45.3,77.9 U1.34 | 48.59,74.3 48.75,74.14 | 48.75,74.14 48.8,74.14 | 48.8,74.14 50.17,74.14 SD.7 50.22,74.09 50.24,74.09 v52,74.09 | R23.1 47.2,72.54 48.8,74.14 | 48.8,74.14 48.75,74.14 | 48.75,74.14 48.59,74.3 | 48.59,74.3 48.59,73.97 | D4.6 58.89,68.39 57.76,69.52 v57.76,74.09
  Bottom 0.305: v57.76,74.09 v52,74.09
IO42/SCLK  (via drill 0.3)
  Top 0.254: 45.11,79.48 45.09,79.5 | 45.09,79.5 45.06,79.5 45.09,79.5 | 45.09,79.5 45.11,79.48 | 45.11,79.48 45.19,79.48 | 45.19,79.48 45.27,79.48 45.19,79.48
  Top 0.305: 45.04,79.48 45.01,79.5 45.01,79.48 U1.35 | D4.5 58.33,66.92 57.97,67.28 57.97,68.28 v56.52,69.72 | v53.17,69.72 R21.1 53.13,67.35 53.11,67.33 | v53.17,69.72 53.17,74.83 51.67,76.33 50.2,76.33 SD.5 49.39,76.32 48.78,76.32 45.93,79.17 45.62,79.48 45.27,79.48 | 53.11,67.33 53.14,67.33 | 53.14,67.33 53.19,67.39 53.17,67.39 53.11,67.44 53.11,67.67 53.14,67.69 53.14,67.39 53.14,67.36 53.11,67.33 | v53.17,69.72 53.17,67.36 53.19,67.33 | 53.19,67.33 53.22,67.31 53.17,67.31 53.19,67.33 | 53.11,67.33 53.14,67.33 | 53.14,67.33 53.19,67.33 | 45.27,79.48 45.19,79.48 | 45.19,79.48 45.11,79.48 | 45.11,79.48 45.04,79.48 | 45.04,79.48 45.04,79.5 45.06,79.5 45.09,79.5 45.14,79.5 45.14,79.45 45.06,79.45 45.09,79.48 45.11,79.48 | 45.04,79.48 45.11,79.48 | 45.11,79.48 45.16,79.43 45.37,79.43 45.32,79.48 45.27,79.48 | 45.27,79.48 45.19,79.48
  Bottom 0.305: v56.52,69.72 v53.17,69.72
IO45  (1 unrouted)
  Top 0.305: U1.26 43.23,66.67 42.83,66.27 42.83,66.14 42.8,66.12 42.8,64.77 42.83,64.75 R7.1
IO48  (via drill 0.3)
  Top 0.305: R41.2 25.1,59.36 v25.1,68.78 | U1.25 41.96,69.04 41.46,69.55 v29.54,69.55
  Bottom 0.305: v29.54,69.55 25.86,69.55 v25.1,68.78
LCD_RST
  Top 0.254: R13.1 36.4,46.38 36.53,46.38
  Top 0.305: P5.15 39,43.91 36.53,46.38 33.38,46.38 33.35,46.41 | 33.35,46.41 33.38,46.41 R16.2 33.4,46.35 33.35,46.41 | 33.35,46.41 34.78,46.41 C1.2
N$1
  Top 0.305: USB-TTL.A5 20.8,11.33 20.83,11.33 R46.2
N$4
  Top 0.305: P5.14 39.5,46.26 35.87,49.89 35.87,59.93 R2.2 35.72,60.06 D1.-
N$5
  Top 0.305: Q2.1 19.53,18.73 R30.1
N$7
  Top 0.406: R12.1 32.03,11.99 PWR.C
N$8  (via drill 0.3)
  Top 0.305: Q1.1 19.11,22.29 v18.06,21.23 | v18.06,17.42 19.31,17.42 R29.1
  Bottom 0.305: v18.06,21.23 v18.06,17.42
N$14
  Top 0.305: USB-NATIVE.A5 49.2,11.1 48.72,11.58 R15.2
N$15
  Top 0.305: U1.13 27.51,70.57 27.51,70.56 23.32,70.56 17.94,65.18 17.94,64.44 17.94,29.92 24.08,23.77 41.74,23.77 43.64,23.77 49.99,17.42 49.99,16.48 49.94,16.48 R20.2
N$16
  Top 0.305: 26.93,69.57 27.19,69.31 U1.14 27.5,69.38 27.31,69.57 23.55,69.57 18.82,64.85 18.82,30.38 24.64,24.56 44.12,24.56 51.34,17.35 R5.2
N$17
  Top 0.305: USB-NATIVE.B5 52.2,11.28 R14.2
N$18
  Top 0.305: USB-TTL.B5 23.8,11.35 R11.2
N$20
  Top 0.305: P5.34 29.5,49.33 31.07,50.9 31.07,52.32 R37.1
N$21
  Top 0.305: P5.35 29,50.74 29.57,51.31 R38.1
N$22
  Top 0.305: P5.36 28.5,51.13 28.02,51.61 R39.1
N$23  (1 unrouted)
  Top 0.305: R40.1 25.61,57.1 27.23,57.1 27.61,57.48 | Q3.1 26.95,57.41 R41.1
N$24  (1 unrouted)
  Top 0.61: R37.2 R38.2 | R38.2 29.06,53.85 | 29.06,53.85 28.07,53.85 | Q3.3 29.26,54.05 | 29.26,54.05 29.06,53.85 | 29.26,54.05 29.36,54.05 R38.2
N$25
  Top 0.254: U8.8 45.93,58.01 45.93,58.19 R52.1
  Top 0.305: R49.2 45.93,57.02 45.93,58.01
N$26  (via drill 0.3)
  Top 0.305: P5.33 30,43.18 v30.51,43.69 | v24.44,43.69 23.4,43.69 R9.1 23.37,43.76 R10.1
  Bottom 0.305: v30.51,43.69 v24.44,43.69
N$36
  Top 0.254: U2.9 12.87,27.4 13.24,27.76 13.24,28.19 R80.2
N$37
  Top 0.254: U2.8 13.87,27.2 14.43,27.76 14.43,28.45 | 14.43,28.45 14.43,28.5 | R79.2 14.43,28.45
N$47  (via drill 0.3)
  Top 0.305: R17.1 50.19,67.91 v49.63,68.47 | v49.1,80.77 50.17,80.77 50.19,80.75 SD.1 | SD.1
  Bottom 0.305: v49.63,68.47 49.63,80.24 v49.1,80.77
N$48
  Top 0.254: SD.8 50.17,73.03
  Top 0.305: R24.1 48.7,72.44 49.28,73.03 50.17,73.03
RESET  (via drill 0.3)
  Top 0.305: 22.94,17.8 Q2.3 22.94,17.8 | 22.94,17.8 24.67,19.53 v24.67,20.52 | v23.45,81.94 23.68,82.17 23.68,83.06 | 23.68,83.06 23.68,83.11 | 23.7,83.03 23.68,83.06 | RST.2 14.24,8.5 20.17,14.43 21.36,14.43 22.91,15.98 22.91,17.75 22.96,17.8 22.94,17.8
  Top 0.61: U1.3 25.37,83.28 R4.1 23.7,83.03 23.68,83.06 C8.1
  Bottom 0.305: v23.45,81.94 22.05,80.54 22.05,25.12 22.08,25.09 24.67,22.5 v24.67,20.52
RTS  (via drill 0.3)
  Top 0.305: v17.15,16.69 17.94,15.9 19.18,15.9 19.28,15.8 R29.2 19.85,15.8 Q2.2 20.86,16.86 20.86,16.92 | v17.15,22.28 17.15,23.09 16.06,24.18 15.87,24.36 U2.6 15.9,24.69
  Bottom 0.305: v17.15,16.69 v17.15,22.28
RXD/IO44  (via drill 0.3)
  Top 0.305: R79.1 15.42,30.99 16.95,32.51 16.95,76.43 20.07,79.55 20.81,80.29 v23.88,80.29 | v39.7,80.72 44.98,80.72 arc90 U1.36
  Bottom 0.305: v23.88,80.29 24.31,80.72 v39.7,80.72
TXD/IO43  (via drill 0.3)
  Top 0.305: R80.1 12.98,30.33 15.93,33.27 15.93,76.63 20.04,80.75 20.42,81.13 22.05,81.13 23.96,81.13 v24.54,81.71 | v39.65,81.71 44.71,81.71 45.01,82.02 U1.37
  Bottom 0.305: v24.54,81.71 v39.65,81.71
USB_D+
  Top 0.305: R5.1 51.2,14.85 USB-NATIVE.B6 51.2,9.13 51.16,9.17 | USB-NATIVE.A6 50.2,9.28 50.4,9.47 51.18,9.47 51.16,9.45 51.16,9.17 | 51.16,9.17 50.85,9.45 51.18,9.78
USB_D-
  Top 0.305: R20.1 50.12,14.78 50.12,11.1 49.7,10.68 USB-NATIVE.B7 49.7,7.28 49.91,7.06 50.52,7.06 50.7,7.24 USB-NATIVE.A7
VBUS  (via drill 0.3)
  Top 0.406: C3.1 C4.2 26.06,14.53 C44.2
  Top 0.61: USB-TTL.VBUS2 24.5,9.26 v24.67,9.42 25.05,9.8 | 19.49,9.35 19.49,9.37 v19.38,9.47 arc-90 19.6,9.26 USB-TTL.VBUS1 | D3.+ 26.06,19.63
  Top 1.016: 25.05,9.8 26.06,10.82 C44.2 26.06,19.63 26.06,20.83 D2.+
  Bottom 0.61: v24.67,9.42 19.43,9.42 v19.38,9.47
XL  (via drill 0.3)
  Top 0.254: U8.4 46.43,46.52 v46.08,46.18 | P5.1 46,43.35 v46.15,43.41
  Bottom 0.254: v46.08,46.18 46.05,46.15
  Bottom 0.305: 46.05,46.15 46.15,46.05 v46.15,43.41
XR  (via drill 0.3)
  Top 0.254: P5.3 45,45.1 v45.44,45.54 | U8.2 45.42,49.28 45.42,48.39 45.32,48.28 45.32,48.29 v45.32,48.3
  Bottom 0.254: v45.44,45.54 45.32,45.67 v45.32,48.3
YD  (1 unrouted)
  Top 0.254: U8.3 45.93,47.09 44.5,45.67 44.5,42.24
YU
  Top 0.254: P5.2 45.5,44.61 46.92,46.02 U8.5

### Text on the board
tPlace: IO4 | IO5 | 3V3 | GND | IO6 | IO7 | 3V3 | GND | www.makerfabs.com | MaTouch Lite ESP32-S3 | SPI TFT with Touch 3.95'' ST7796 v1.1